# EAGLE design teslasolar (EAGLE 7.2.0)
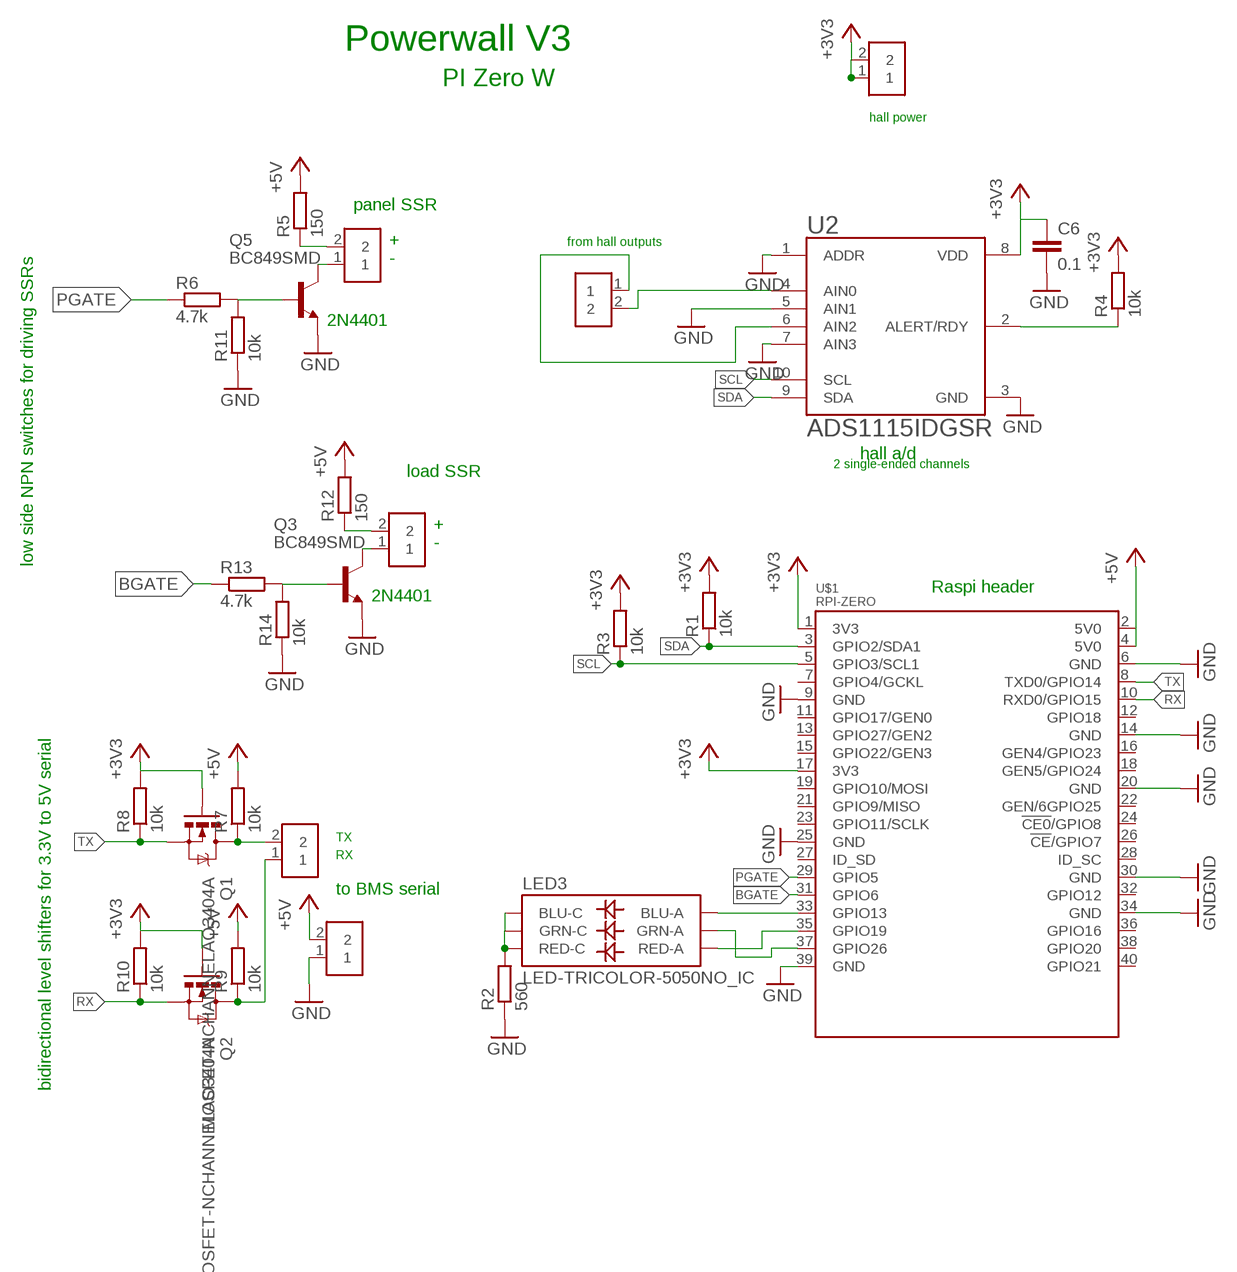
[diagram p0: schematic, sheet 1]

## Parts
C6  0.1  C-EUC0603  [C0603]
J1  282834-2  [CONN_282834-2]
J2  282834-2  [CONN_282834-2]
J3  282834-2  [CONN_282834-2]
J4  282834-2  [CONN_282834-2]
J5  282834-2  [CONN_282834-2]
J6  282834-2  [CONN_282834-2]
LED3  LED-TRICOLOR-5050NO_IC  [LED-TRICOLOR-5050]
Q1  MOSFET-NCHANNELAO3404A  [SOT23-3]
Q2  MOSFET-NCHANNELAO3404A  [SOT23-3]
Q3  BC849SMD  [SOT23-BEC]
Q5  BC849SMD  [SOT23-BEC]
R1  10k  R-EU_R0603  [R0603]
R2  560  R-EU_R0805  [R0805]
R3  10k  R-EU_R0603  [R0603]
R4  10k  R-EU_R0603  [R0603]
R5  150  R-EU_R0603  [R0603]
R6  4.7k  R-EU_R0603  [R0603]
R7  10k  R-EU_R0603  [R0603]
R8  10k  R-EU_R0603  [R0603]
R9  10k  R-EU_R0603  [R0603]
R10  10k  R-EU_R0603  [R0603]
R11  10k  R-EU_R0603  [R0603]
R12  150  R-EU_R0603  [R0603]
R13  4.7k  R-EU_R0603  [R0603]
R14  10k  R-EU_R0603  [R0603]
U2  ADS1115IDGSR  [SOP50P490X110-10N]
U$1  RPI-ZERO  [RASPBERRYPI_BASTELSTUBE_V13_RASPI_BOARD_B+_FULL]

## Nets
3V3@2: U$1.17(3V3) ; supply symbol labelled +3V3
+3V3: C6.1 J4.1 J4.2 Q1.1(G) Q2.1(G) R1.2 R3.2 R4.2 R8.2 R10.2 U2.8(VDD) U$1.1(3V3)
+5V: J5.2 R5.2 R7.2 R9.2 R12.2 U$1.2(5V0) U$1.4(5V0)
BGATE: R13.1 U$1.31(GPIO6)
GND: C6.2 J5.1 Q3.E Q5.E R2.1 R11.1 R14.1 U2.1(ADDR) U2.3(GND) U2.5(AIN1) U2.7(AIN3) U$1.6(GND) U$1.9(GND) U$1.14(GND) U$1.20(GND) U$1.25(GND) U$1.30(GND) U$1.34(GND) U$1.39(GND)
N$1: LED3.3(BLU-A) U$1.33(GPIO13)
N$2: LED3.2(RED-A) U$1.35(GPIO19)
N$3: LED3.1(GRN-A) U$1.37(GPIO26)
N$4: LED3.4(BLU-C) LED3.5(RED-C) LED3.6(GRN-C) R2.2
N$5: J3.2 Q1.3(D) R7.1
N$6: J3.1 Q2.3(D) R9.1
N$7: J1.2 R5.1
N$8: J6.2 R12.1
N$9: J1.1 Q5.C
N$10: Q5.B R6.2 R11.2
N$11: J6.1 Q3.C
N$12: Q3.B R13.2 R14.2
N$13: R4.1 U2.2(ALERT/RDY)
N$14: J2.1 U2.6(AIN2)
N$16: J2.2 U2.4(AIN0)
PGATE: R6.1 U$1.29(GPIO5)
RX: Q2.2(S) R10.1 U$1.10(RXD0/GPIO15)
SCL: R3.1 U2.10(SCL) U$1.5(GPIO3/SCL1)
SDA: R1.1 U2.9(SDA) U$1.3(GPIO2/SDA1)
TX: Q1.2(S) R8.1 U$1.8(TXD0/GPIO14)
Unconnected: U$1.7(GPIO4/GCKL) U$1.11(GPIO17/GEN0) U$1.12(GPIO18) U$1.13(GPIO27/GEN2) U$1.15(GPIO22/GEN3) U$1.16(GEN4/GPIO23) U$1.18(GEN5/GPIO24) U$1.19(GPIO10/MOSI) U$1.21(GPIO9/MISO) U$1.22(GEN/6GPIO25) U$1.23(GPIO11/SCLK) U$1.24(!CE0!/GPIO8) U$1.26(!CE!/GPIO7) U$1.27(ID_SD) U$1.28(ID_SC) U$1.32(GPIO12) U$1.36(GPIO16) U$1.38(GPIO20) U$1.40(GPIO21)

## Notes on the sheet
- Powerwall V3
- PI Zero W
- hall power
- panel SSR
- + | from hall outputs
- -
- 2N4401
- hall a/d
- 2 single-ended channels
- load SSR
- +
- -
- low side NPN switches for driving SSRs
- Raspi header
- 2N4401
- TX
- RX
- to BMS serial
- bidirectional level shifters for 3.3V to 5V serial

## Library data of the parts
C6 = rcl:C-EU: CAPACITOR, European symbol
J1-J6 = 282834-2:282834-2: Terminal block; 2.54mm; angled 90°; 0.03÷1mm2; ways: 2; 10A; H: 10mm; CENTERLINE_PITCH: 2.54 mm[.1 in]; COMMENT: 282834-2; DESCRIPTION: TERMI-BLOK PCB MOUNT, 90 2P.; DIGI-KEY_PART_NUMBER: A98333-ND; DIGI-KEY_PURCHASE_URL: https://www.digikey.com/product-detail/en/te-connectivity-amp-connectors/282834-2/A98333-ND/1150135?utm_source=snapeda&utm_medium=aggregator&utm_campaign=symbol; EU_ROHS_COMPLIANCE: Compliant with Exemptions; MF: TE Connectivity; MP: 282834-2; NUMBER_OF_POSITIONS: 2; PACKAGE: None; TE_PURCHASE_URL: https://www.te.com/usa-en/product-282834-2.html?te_bu=Cor&te_type=disp&te_campaign=seda_glo_cor-seda-global-disp-prtnr-fy19-seda-model-bom-cta_sma-317_1&elqCampaignId=32493
LED3 = SparkFun-LED:LED-TRICOLOR-5050
Q1 Q2 = SparkFun-DiscreteSemi:MOSFET-NCHANNEL: Common NMOSFET Parts MFG P/N Store ID Prod ID FDD8780 TRANS-09984 SI7820DN TRANS-11055 FDS6630A IC-08089 2N7002PW TRANS-11151 FQP30N06L COM-10213 TRANS-10060 BSS123LT1G TRANS-08345 BSS138 TRANS-00830 BS170 2N7000; PROD_ID: TRAN-12988
Q3 Q5 = transistor-npn:BC849*: NPN Transistor
R1-R14 = rcl:R-EU_: RESISTOR, European symbol
U2 = ADS1115IDGSR:ADS1115IDGSR: 16-Bit ADC with Integrated MUX, PGA, Comparator, Oscillator, and Reference 10-VSSOP -40 to 125; DESCRIPTION: 16-Bit ADC with Integrated MUX, PGA, Comparator, Oscillator, and Reference 10-VSSOP -40 to 125; DIGI-KEY_PART_NUMBER: 296-38849-1-ND; DIGI-KEY_PURCHASE_URL: https://www.digikey.com/product-detail/en/texas-instruments/ADS1115IDGSR/296-38849-1-ND/5142969?utm_source=snapeda&utm_medium=aggregator&utm_campaign=symbol; MF: Texas Instruments; MP: ADS1115IDGSR; PACKAGE: MSOP-10 Texas Instruments
U$1 = RPI-Zero:RPI-ZERO

## Net classes
0 default: width 0.152 mm, drill 0.305 mm, clearance 0.152 mm

## Board
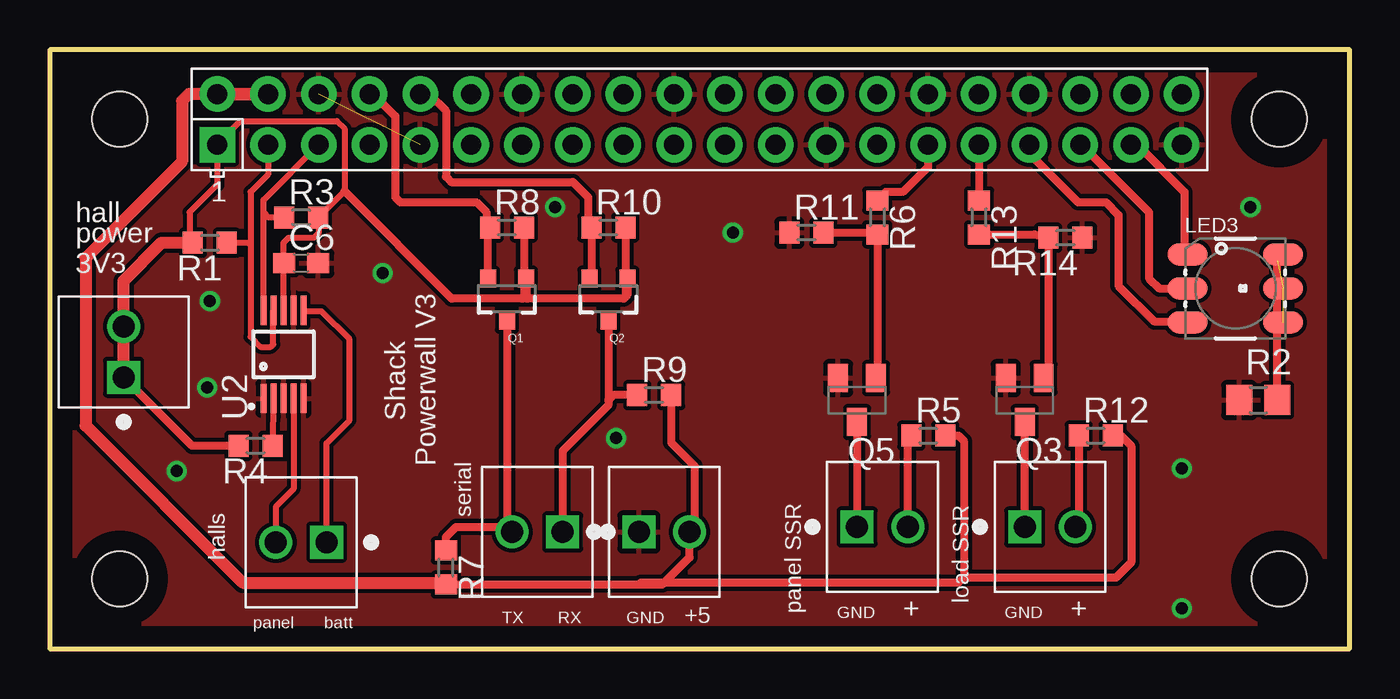
[diagram p1: board, top side]
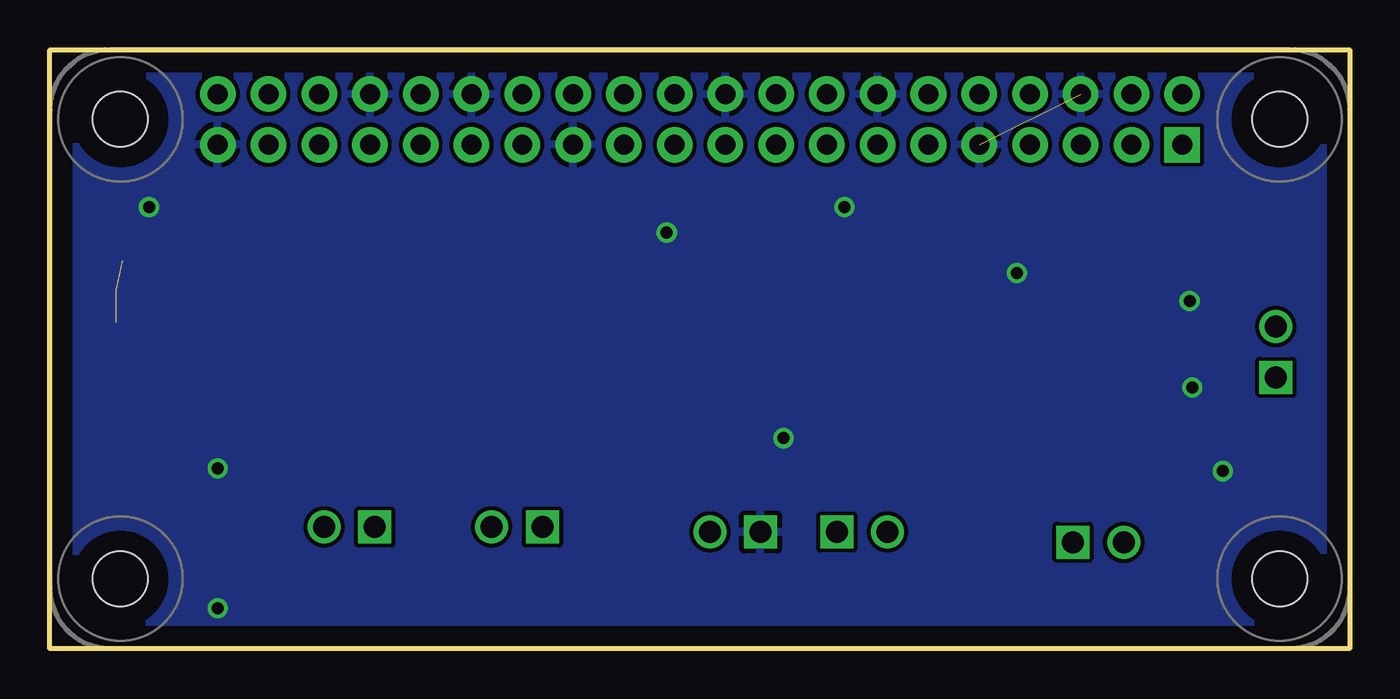
[diagram p2: board, bottom side, seen from below]

Size 65.02 x 29.97 mm. Coordinates in mm from the lower left corner, seen from the top.
Outline: 0,0 65.02,0 65.02,29.97 0,29.97 0,0
Copper layers (1*16): Top 0.035mm / dielectric 1.5mm / Bottom 0.035mm
Design rules "default": minimum track width 10mil, minimum drill 24mil, track to track 8mil, track to pad 8mil, pad to pad 8mil, via to via 8mil, smd to smd 8mil, copper to edge 40mil, drill to drill 8mil, minimum pad ring 10mil, minimum via ring 8mil, stop-mask expansion 4mil, vias tented up to drill 0mil, thermal gap 10mil

### Footprints (pad centres in the part's own frame; a part is rotated, then mirrored left to right if it is on the bottom)
C0603 = smd 1.1 x 1: 1 -0.85,0; 2 0.85,0
CONN_282834-2 = drill 1.1 square: 1 -1.27,0 | drill 1.1: 2 1.27,0
LED-TRICOLOR-5050 = smd 2 x 1.1: 1 -2.4,1.7; 2 -2.4,0; 3 -2.4,-1.7; 4 2.4,-1.7; 5 2.4,0; 6 2.4,1.7
SOT23-3 = smd 0.8 x 0.9: 1 -0.95,-1; 2 0.95,-1; 3 0,1.1
SOT23-BEC = smd 1 x 1.4: B -0.95,-1.1; C 0,1.1; E 0.95,-1.1
R0603 = smd 1 x 1.1: 1 -0.85,0; 2 0.85,0
R0805 = smd 1.3 x 1.5: 1 -0.95,0; 2 0.95,0
SOP50P490X110-10N = smd 1.45 x 0.3: 1 -2.2,1 | smd 1.47 x 0.3: 2 -2.2,0.5; 3 -2.2,0; 4 -2.2,-0.5; 5 -2.2,-1; 6 2.2,-1; 7 2.2,-0.5; 8 2.2,0; 9 2.2,0.5; 10 2.2,1
RASPBERRYPI_BASTELSTUBE_V13_RASPI_BOARD_B+_FULL = drill 1 pad 1.778 square: 1 8.37,25.23 | drill 1 pad 1.778: 2 8.37,27.77; 3 10.91,25.23; 4 10.91,27.77; 5 13.45,25.23; 6 13.45,27.77; 7 15.99,25.23; 8 15.99,27.77; 9 18.53,25.23; 10 18.53,27.77; 11 21.07,25.23; 12 21.07,27.77; 13 23.61,25.23; 14 23.61,27.77; 15 26.15,25.23; 16 26.15,27.77; 17 28.69,25.23; 18 28.69,27.77; 19 31.23,25.23; 20 31.23,27.77; 21 33.77,25.23; 22 33.77,27.77; 23 36.31,25.23; 24 36.31,27.77; 25 38.85,25.23; 26 38.85,27.77; 27 41.39,25.23; 28 41.39,27.77; 29 43.93,25.23; 30 43.93,27.77; 31 46.47,25.23; 32 46.47,27.77; 33 49.01,25.23; 34 49.01,27.77; 35 51.55,25.23; 36 51.55,27.77; 37 54.09,25.23; 38 54.09,27.77; 39 56.63,25.23; 40 56.63,27.77 | hole 2.75: 3.5,3.5; 3.5,26.5; 61.5,3.5; 61.5,26.5

### Placement (x,y rotation side)
C6  12.57,19.3 0 top
J1  41.66,6.1 0 top
J2  12.57,5.33 180 top
J3  24.38,5.84 180 top
J4  3.68,14.86 90 top
J5  30.73,5.84 0 top
J6  50.04,6.1 0 top
LED3  59.31,18.03 0 top
Q1  22.86,17.53 180 top
Q2  27.94,17.53 180 top
Q3  48.77,12.45 180 top
Q5  40.39,12.45 180 top
R1  8,20.32 180 top
R2  60.45,12.45 0 top
R3  12.57,21.59 0 top
R4  10.29,10.16 180 top
R5  43.94,10.67 0 top
R6  41.4,21.59 270 top
R7  19.81,4.06 270 top
R8  22.86,21.08 0 top
R9  30.23,12.7 0 top
R10  27.94,21.08 0 top
R11  37.85,20.83 0 top
R12  52.32,10.67 0 top
R13  46.48,21.59 270 top
R14  50.8,20.57 180 top
U2  11.68,14.73 90 top
U$1  0,0 0 top

### Tracks (layer width: path | path; a pad name or v marks a point on that pad's centre or on a via)
+3V3
  Top 0.305: U2.8 11.68,19.27 | 11.68,19.27 C6.1 | R1.2 6.99,20.49 6.99,21.84 8.37,23.23 U$1.1 8.37,25.26 9.53,26.42 14.35,26.42 14.73,26.04 14.73,22.9 R3.2 13.46,21.55 13.46,20.83 13.21,20.57 11.94,20.57 11.68,20.32 11.68,19.27
  Top 0.406: R4.2 7.11,10.16 J4.1 | R8.2 23.71,18.63 | 23.71,18.63 Q1.1 23.88,18.46 23.88,17.53 | R10.2 28.79,18.63 | 28.79,18.63 Q2.1 28.89,17.71 28.79,17.61 | 28.79,18.63 28.79,17.61 | 28.79,17.61 28.7,17.53 23.62,17.53 | 23.62,17.53 20.11,17.53 14.73,22.9 | 23.71,18.63 23.71,17.61 23.62,17.53
  Top 0.61: R1.2 5.59,20.32 3.68,18.41 J4.2 J4.1
+5V
  Top 0.406: R7.2 29.46,3.21 | 29.46,3.21 30.65,3.21 32,4.57 32,5.33 | 32,5.33 J5.2 | R9.2 31.08,10.33 32.26,9.14 32.26,5.59 32,5.33 | 45.72,3.56 45.47,3.3 29.55,3.3 29.46,3.21 | 45.72,3.56 53.34,3.56 54.1,4.32 54.1,10.16 53.59,10.67 R12.2 | R5.2 45.47,10.67 45.72,10.41 45.72,3.56
  Top 0.61: U$1.2 U$1.4 6.94,27.77 6.6,27.43 6.6,24.38 1.78,19.56 1.78,11.18 9.65,3.3 19.72,3.3 R7.2
BGATE
  Top 0.406: U$1.31 46.47,22.45 R13.1
GND  (via drill 0.6)  (1 unrouted)
  other vias: 8,17.4 7.87,13.08 34.16,20.83 6.35,8.89 56.64,2.03 28.32,10.54 56.64,9.02 16.64,18.8 60.07,22.1 25.27,22.1
  pour Bottom: 0,0 65.02,0 65.02,29.97 0,29.97
  pour Top: 0,0 65.02,0 65.02,29.97 0,29.97
N$1
  Top 0.406: U$1.33 49.01,24.78 51.44,22.35 52.83,22.35 53.47,21.72 53.47,18.16 55.24,16.38 56.86,16.38 LED3.3
N$2
  Top 0.406: U$1.35 51.6,25.23 54.99,21.84 54.99,18.54 55.5,18.03 LED3.2
N$3
  Top 0.406: U$1.37 54.4,25.23 56.77,22.86 56.77,19.87 LED3.1
N$4  (2 unrouted)
  Top 0.406: R2.2 61.4,19.43 LED3.6
N$5
  Top 0.406: Q1.3 22.86,6.1 | R7.1 19.81,5.59 20.32,6.1 22.86,6.1 | 22.86,6.1 J3.2
N$6
  Top 0.406: Q2.3 27.94,12.45 | 27.94,12.45 27.94,12.19 25.65,9.91 J3.1 | R9.1 28.19,12.7 27.94,12.45
N$7
  Top 0.406: J1.2 42.93,10.5 R5.1
N$8
  Top 0.406: R12.1 51.47,6.26 J6.2
N$9
  Top 0.406: Q5.C J1.1
N$10
  Top 0.406: Q5.B 41.4,13.61 R6.2 41.31,20.83 R11.2
N$11
  Top 0.406: J6.1 Q3.C
N$12
  Top 0.406: R13.2 49.28,20.74 R14.2 49.95,13.78 Q3.B
N$13
  Top 0.305: U2.2 R4.1
N$14
  Top 0.305: J2.1 13.84,10.29 14.99,11.43 14.99,15.49 13.59,16.89 12.72,16.89 U2.6
N$16
  Top 0.305: U2.4 12.18,7.99 11.3,7.11 J2.2
PGATE
  Top 0.406: U$1.29 43.93,24.12 42.67,22.86 41.82,22.86 R6.1
RX
  Top 0.406: 26.92,18.59 Q2.2 27.09,18.63 R10.1 26.92,21.25 26.92,22.61 26.16,23.37 20.07,23.37 19.81,23.62 19.81,26.92 18.97,27.77 U$1.10
SCL
  Top 0.305: U2.10 10.68,21.84 | 10.68,21.84 10.68,22.46 U$1.5 | R3.1 10.94,21.59 10.68,21.84
SDA
  Top 0.305: 11.18,16.76 U2.9 11.18,15.24 11.05,15.11 10.54,15.11 10.03,15.62 10.03,20.19 | U$1.3 10.91,23.74 10.03,22.86 10.03,20.19 | R1.1 9.91,20.32 10.03,20.19
TX
  Top 0.406: U$1.8 16.17,27.77 17.27,26.67 17.27,22.61 17.53,22.35 21.34,22.35 21.84,21.84 21.84,21.25 R8.1 21.91,20.98 Q1.2

### Text on the board
tNames: hall | power | 3V3 | Shack | Powerwall V3 | serial | halls | panel SSR | GND | + | load SSR | GND | + | panel | batt | TX | RX | GND | +5